# EAGLE design LCD-BackPack_v11 (EAGLE 7.5.0)
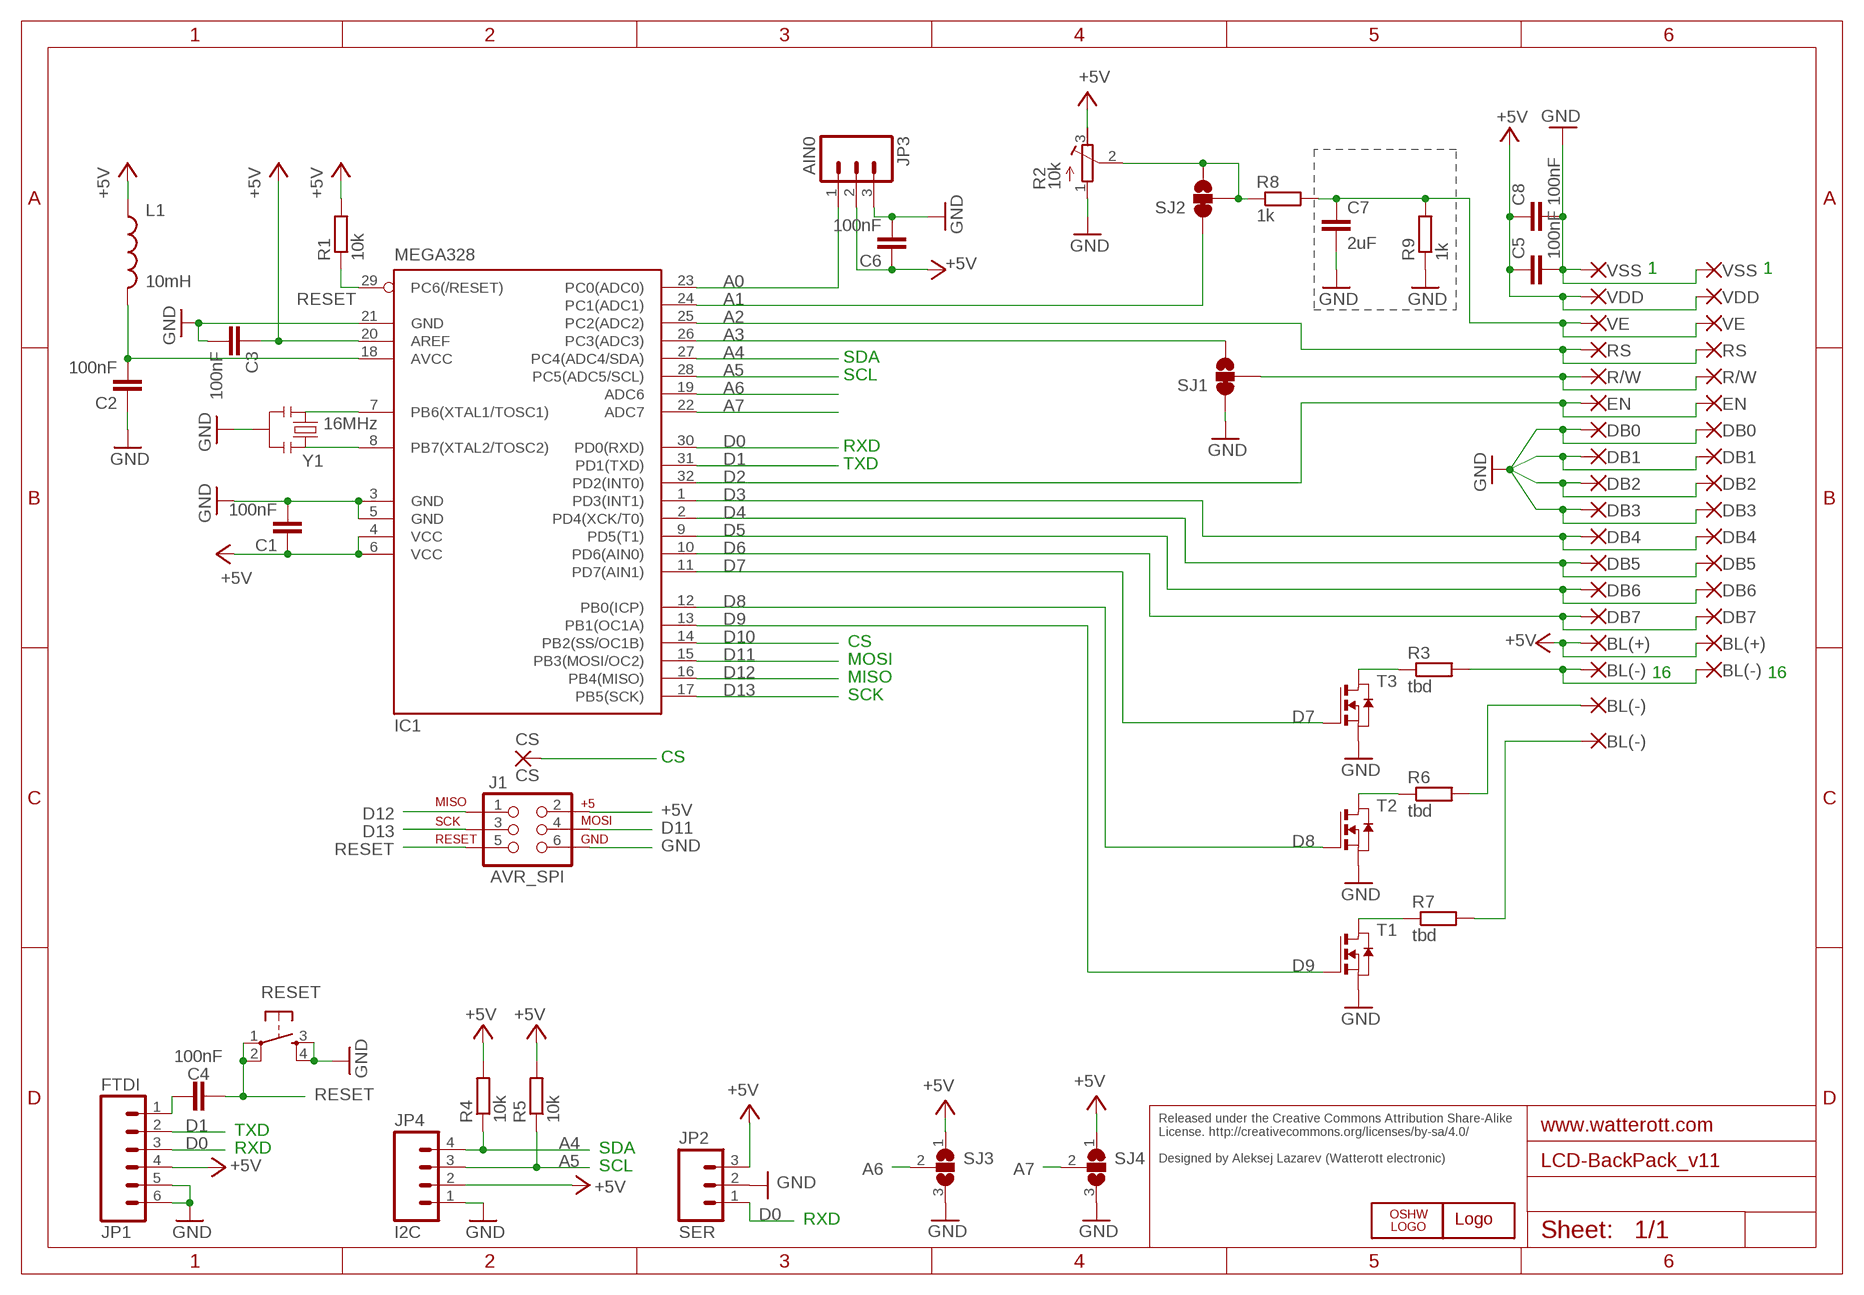
[diagram p0: schematic, sheet 1]

## Parts
C1  100nF  C-EUC0603  [C0603]
C2  100nF  C-EUC0603  [C0603]
C3  100nF  C-EUC0603  [C0603]
C4  100nF  C-EUC0603  [C0603]
C5  100nF  C-EUC0603  [C0603]
C6  100nF  C-EUC0603  [C0603]
C7  2uF  C-EUC0603  [C0603]
C8  100nF  C-EUC0603  [C0603]
CS  CS  1,6/0,9  [1,6/0,9]
IC1  MEGA328  MEGA8-AI  [TQFP32-08]
J1  AVR_SPI  AVR_SPI_PRG_6PTH  [2X3]
JP1  FTDI  M06SIP  [1X06]
JP2  SER  M03PTH  [1X03]
JP3  AIN0  M03PTH  [1X03]
JP4  I2C  M04PTH  [1X04]
L1  10mH  INDUCTOR30OHM,1.8A  [0603]
LOGO1  OSHW_LOGO_6MILX0150-NT  [OSHW_6X150_NOTEXT]
P1  VSS  1,6/0,9  [1,6/0,9]
P2  VDD  1,6/0,9  [1,6/0,9]
P3  VE  1,6/0,9  [1,6/0,9]
P4  RS  1,6/0,9  [1,6/0,9]
P5  R/W  1,6/0,9  [1,6/0,9]
P6  EN  1,6/0,9  [1,6/0,9]
P7  DB0  1,6/0,9  [1,6/0,9]
P8  DB1  1,6/0,9  [1,6/0,9]
P9  DB2  1,6/0,9  [1,6/0,9]
P10  DB3  1,6/0,9  [1,6/0,9]
P11  DB4  1,6/0,9  [1,6/0,9]
P12  DB5  1,6/0,9  [1,6/0,9]
P13  DB6  1,6/0,9  [1,6/0,9]
P14  DB7  1,6/0,9  [1,6/0,9]
P15  BL(+)  1,6/0,9  [1,6/0,9]
P16  BL(-)  1,6/0,9  [1,6/0,9]
P17  BL(-)  1,6/0,9  [1,6/0,9]
P18  BL(-)  1,6/0,9  [1,6/0,9]
P19  VSS  1,6/0,9  [1,6/0,9]
P20  VDD  1,6/0,9  [1,6/0,9]
P21  VE  1,6/0,9  [1,6/0,9]
P22  RS  1,6/0,9  [1,6/0,9]
P23  R/W  1,6/0,9  [1,6/0,9]
P24  EN  1,6/0,9  [1,6/0,9]
P25  DB0  1,6/0,9  [1,6/0,9]
P26  DB1  1,6/0,9  [1,6/0,9]
P27  DB2  1,6/0,9  [1,6/0,9]
P28  DB3  1,6/0,9  [1,6/0,9]
P29  DB4  1,6/0,9  [1,6/0,9]
P30  DB5  1,6/0,9  [1,6/0,9]
P31  DB6  1,6/0,9  [1,6/0,9]
P32  DB7  1,6/0,9  [1,6/0,9]
P33  BL(+)  1,6/0,9  [1,6/0,9]
P34  BL(-)  1,6/0,9  [1,6/0,9]
R1  10k  R-EU_R0603  [R0603]
R2  10k  R-TRIMM3374  [RTRIM3374]
R3  tbd  R-EU_R0603  [R0603]
R4  10k  R-EU_R0603  [R0603]
R5  10k  R-EU_R0603  [R0603]
R6  tbd  R-EU_R0603  [R0603]
R7  tbd  R-EU_R0603  [R0603]
R8  1k  R-EU_R0603  [R0603]
R9  1k  R-EU_R0603  [R0603]
RESET  TAC_SWITCHSMD  [TACTILE_SWITCH_SMD]
SJ1  SOLDERJUMPER_2WAY-OLDS  [SJ_3]
SJ2  SOLDERJUMPER_2WAY-OLDS  [SJ_3]
SJ3  SJ2W  [SJ_2]
SJ4  SJ2W  [SJ_2]
T1  NMOSSOT23  [SOT-23]
T2  NMOSSOT23  [SOT-23]
T3  NMOSSOT23  [SOT-23]
U$1  WE-LOGO  WE-LOGOPLACE  [WE-LOGO]
Y1  16MHz  RESONATOR16MHZ  [RESONATOR-SMD]

## Nets
+5V: C1.1 C3.1 C5.1 C6.1 C8.1 IC1.4(VCC) IC1.6(VCC) IC1.20(AREF) J1.2 JP1.4 JP2.3 JP3.2 JP4.2 L1.1 P2.1(P) P15.1(P) P20.1(P) P33.1(P) R1.2 R2.3(A) R4.2 R5.2 SJ3.1 SJ4.1
A0: IC1.23(PC0(ADC0)) JP3.1
A1: IC1.24(PC1(ADC1)) SJ2.1
A2: IC1.25(PC2(ADC2)) P4.1(P) P22.1(P)
A3: IC1.26(PC3(ADC3)) SJ1.3
A4: IC1.27(PC4(ADC4/SDA)) JP4.4 R4.1
A5: IC1.28(PC5(ADC5/SCL)) JP4.3 R5.1
A6: IC1.19(ADC6) SJ3.2
A7: IC1.22(ADC7) SJ4.2
AVCC: C2.2 IC1.18(AVCC) L1.2
D0: IC1.30(PD0(RXD)) JP1.3 JP2.1
D1: IC1.31(PD1(TXD)) JP1.2
D2: IC1.32(PD2(INT0)) P6.1(P) P24.1(P)
D3: IC1.1(PD3(INT1)) P11.1(P) P29.1(P)
D4: IC1.2(PD4(XCK/T0)) P12.1(P) P30.1(P)
D5: IC1.9(PD5(T1)) P13.1(P) P31.1(P)
D6: IC1.10(PD6(AIN0)) P14.1(P) P32.1(P)
D7: IC1.11(PD7(AIN1)) T3.3(G)
D8: IC1.12(PB0(ICP)) T2.3(G)
D9: IC1.13(PB1(OC1A)) T1.3(G)
D10: CS.1(P) IC1.14(PB2(SS/OC1B))
D11: IC1.15(PB3(MOSI/OC2)) J1.4
D12: IC1.16(PB4(MISO)) J1.1
D13: IC1.17(PB5(SCK)) J1.3
GND: C1.2 C2.1 C3.2 C5.2 C6.2 C7.2 C8.2 IC1.3(GND) IC1.5(GND) IC1.21(GND) J1.6 JP1.5 JP1.6 JP2.2 JP3.3 JP4.1 P1.1(P) P7.1(P) P8.1(P) P9.1(P) P10.1(P) P19.1(P) P25.1(P) P26.1(P) P27.1(P) P28.1(P) R2.1(E) R9.1 RESET.3 RESET.4 SJ1.1 SJ3.3 SJ4.3 T1.2(S) T2.2(S) T3.2(S) Y1.2
N$3: R6.1 T2.1(D)
N$4: P18.1(P) R7.2
N$5: C4.2 JP1.1
N$7: R3.1 T3.1(D)
N$8: P17.1(P) R6.2
N$11: R7.1 T1.1(D)
N$16: P16.1(P) P34.1(P) R3.2
RESET: C4.1 IC1.29(PC6(/RESET)) J1.5 R1.1 RESET.1 RESET.2
RW: P5.1(P) P23.1(P) SJ1.2
VE: C7.1 P3.1(P) P21.1(P) R8.2 R9.2
VPOT: R2.2(S) R8.1 SJ2.2 SJ2.3
XTAL1: IC1.7(PB6(XTAL1/TOSC1)) Y1.1
XTAL2: IC1.8(PB7(XTAL2/TOSC2)) Y1.3

## Notes on the sheet
- 1 | 1
- SDA
- SCL
- RXD
- TXD
- CS
- MOSI
- MISO | 16 | 16
- SCK
- CS
- Released under the Creative Commons Attribution Share-Alike 
  License. http://creativecommons.org/licenses/by-sa/4.0/
  
  Designed by Aleksej Lazarev (Watterott electronic)
- TXD
- RXD | SDA
- SCL
- RXD

## Library data of the parts
C1-C8 = resistor:C-EU: CAPACITOR, European symbol
CS P1-P34 = wirepad:1,6/0,9: THROUGH-HOLE PAD
IC1 = atmel:MEGA8: MICROCONTROLLER 8 Kbytes FLASH, 1 kbytes SRAM, 512 bytes EEPROM, USART, 6-channel 10 bit ADC, 2-channel 8 bit ADC Pin compatible with Atmega48, ATMega88, ATMega168 Source: avr.lbr; MPN: ATMEGA8-16AU; OC_FARNELL: 9171371; OC_NEWARK: 73M8863
J1 = SparkFun-Connectors:AVR_SPI_PRG_6: AVR ISP 6 Pin This is the reduced ISP connector for AVR programming. Common on Arduino. This footprint will take up less PCB space and can be used with a 10-pin to 6-pin adapter such as SKU: BOB-08508
JP1 = SparkFun-Connectors:M06: Header 6 Standard 6-pin 0.1" header. Use with straight break away headers (SKU : PRT-00116), right angle break away headers (PRT-00553), swiss pins (PRT-00743), machine pins (PRT-00117), and female headers (PRT-00115). Molex polarized connector foot print use with SKU : PRT-08094 with associated crimp pins and housings. NOTES ON THE VARIANTS LOCK and LOCK_LONGPADS... This footprint was designed to help hold the alignment of a through-hole component (i.e. 6-pin header) while soldering it into place. You may notice that each hole has been shifted either up or down by 0.005 of an inch from it's more standard position (which is a perfectly straight line). This slight alteration caused the pins (the squares in the middle) to touch the edges of the holes. Because they are alternating, it causes a "brace" to hold the component in place. 0.005 has proven to be the perfect amount of "off-center" position when using our standard breakaway headers. Although looks a little odd when you look at the bare footprint, once you have a header in there, the alteration is very hard to notice. Also,if you push a header all the way into place, it is covered up entirely on the bottom side. This idea of altering the position of holes to aid alignment will be further integrated into the Sparkfun Library for other footprints. It can help hold any component with 3 or more connection pins.
JP2 JP3 = SparkFun-Connectors:M03: Header 3 Standard 3-pin 0.1" header. Use with straight break away headers (SKU : PRT-00116), right angle break away headers (PRT-00553), swiss pins (PRT-00743), machine pins (PRT-00117), and female headers (PRT-00115). Molex polarized connector foot print use with SKU : PRT-08232 with associated crimp pins and housings.
JP4 = SparkFun-Connectors:M04: Header 4 Standard 4-pin 0.1" header. Use with straight break away headers (SKU : PRT-00116), right angle break away headers (PRT-00553), swiss pins (PRT-00743), machine pins (PRT-00117), and female headers (PRT-00115). Molex polarized connector foot print use with SKU : PRT-08231 with associated crimp pins and housings. 1MM SMD Version SKU: PRT-10208
L1 = SparkFun-Passives:INDUCTOR: Inductors Basic Inductor/Choke - 0603 and 1206. Footprints are not proven and vary greatly between part numbers. SRN6045- 33uH, 20% 1.4A SDR0403-560KL - 56uH, 10%, 500mA RMS/740mA peak; PROD_ID: RES-07859
LOGO1 = OSHW:OSHW_LOGO_6MIL
R1 R3-R9 = resistor:R-EU_: RESISTOR, European symbol
R2 = resistor:R-TRIMM: Trimm resistor
RESET = SparkFun-Electromechanical:TAC_SWITCH: Momentary Switch Button commonly used for reset or general input. Spark Fun Electronics SKU : COM-00097 SMT- SWCH-08247; PROD_ID: SWCH-08247
SJ1 SJ2 = SparkFun-Passives:SOLDERJUMPER_2WAY-OLD: Solder Jumper 2 way solder jumper
SJ3 SJ4 = jumper:SJ2W: SMD solder JUMPER
T1-T3 = zetex:NMOSSOT23: MOS FET; OC_FARNELL: unknown; OC_NEWARK: unknown
U$1 = welectronic:WE-LOGO
Y1 = SparkFun-FreqCtrl:RESONATOR: Resonator Small SMD resonator. Used, eg, on the Arduino Pro/ Pro Mini boards. 8MHz- XTAL-08895 16MHz- XTAL-08900; PROD_ID: XTAL-08900

## Board
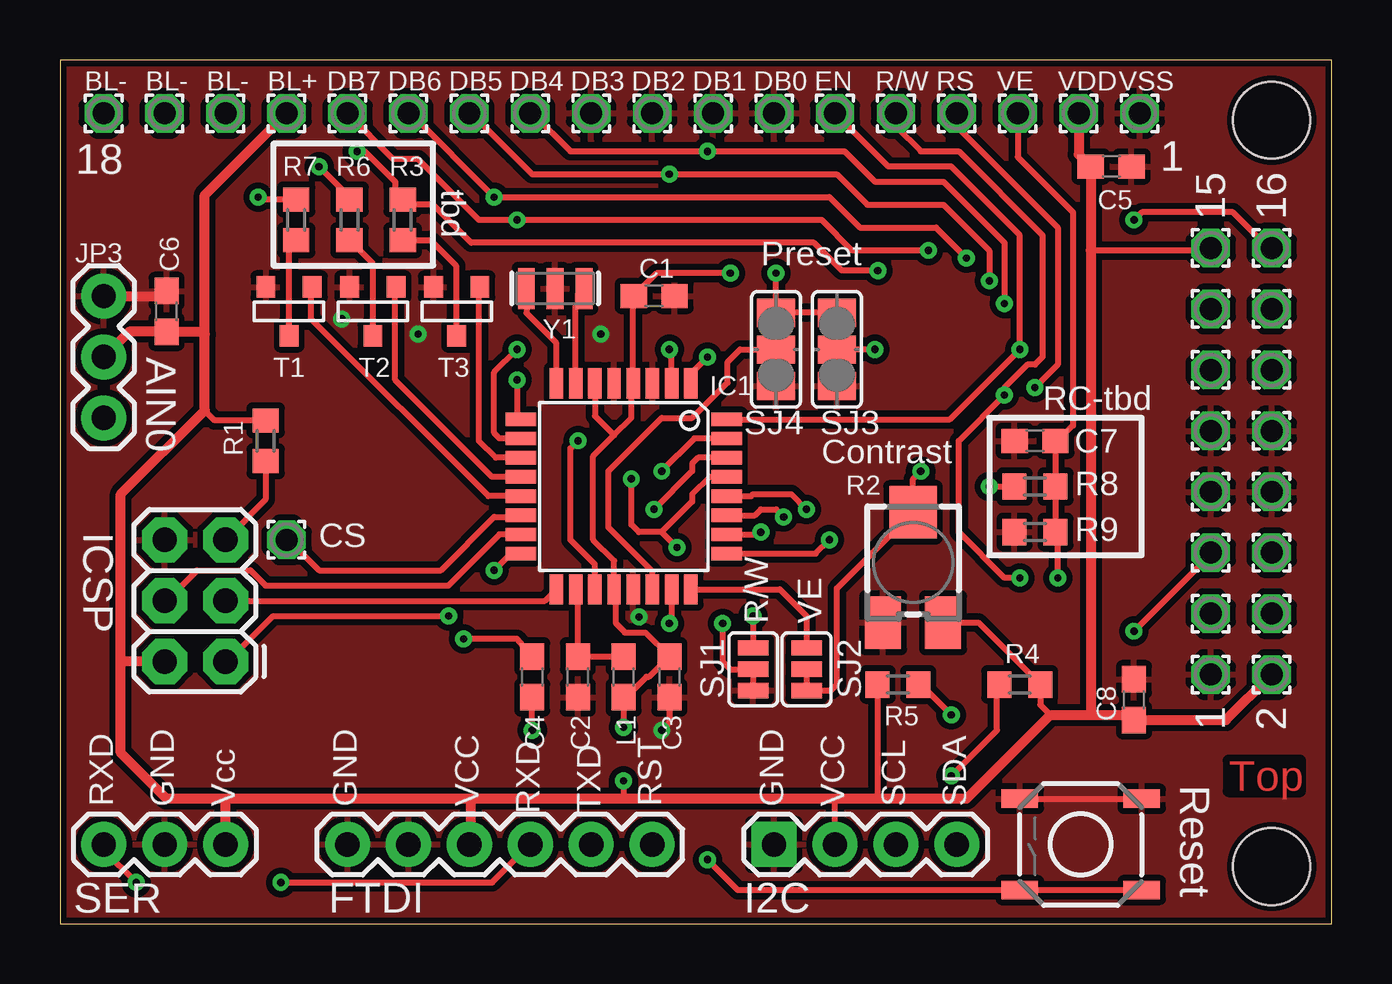
[diagram p1: board, top side]
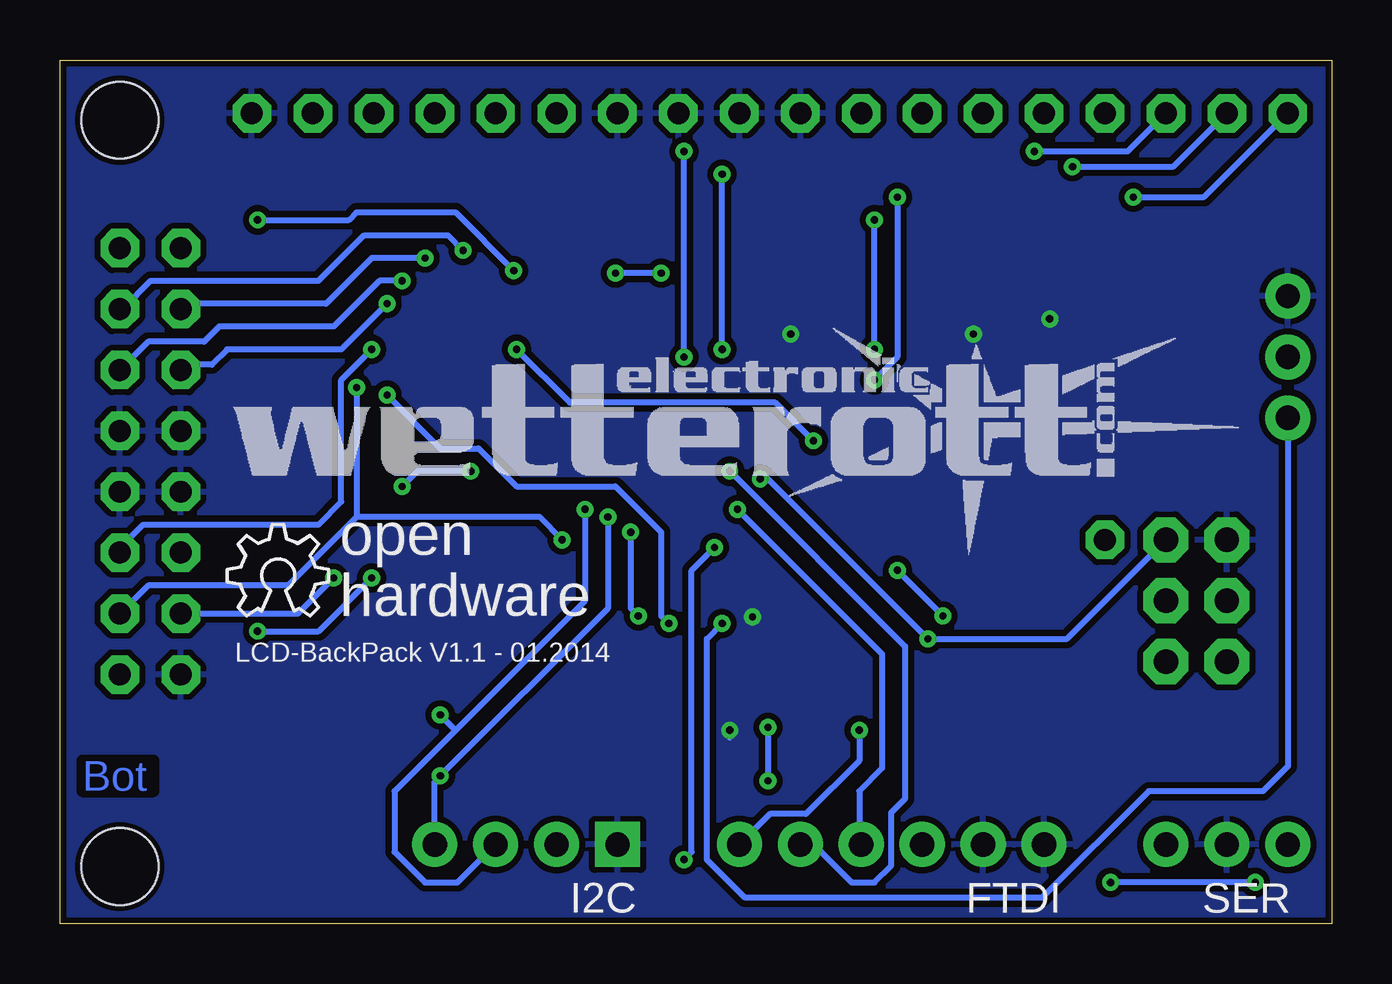
[diagram p2: board, bottom side, seen from below]

Size 53 x 36 mm. Coordinates in mm from the lower left corner, seen from the top.
Outline: 0,0 53,0 53,36 0,36 0,0
Copper layers (1*16): Top 0.035mm / dielectric 1.5mm / Bottom 0.035mm
Design rules "watterott *": minimum track width 0.1mm, minimum drill 0.3mm, track to track 0.15mm, track to pad 0.15mm, pad to pad 0.15mm, via to via 0.15mm, smd to smd 0.15mm, copper to edge 10mil, drill to drill 8mil, minimum pad ring 10mil, minimum via ring 8mil, stop-mask expansion 4mil, vias tented up to drill 0.4mm, thermal gap 10mil
Holes 3.2 mm at 50.5,33.49 50.5,2.38

### Footprints (pad centres in the part's own frame; a part is rotated, then mirrored left to right if it is on the bottom)
C0603 = smd 1.1 x 1: 1 -0.85,0; 2 0.85,0
1,6/0,9 = drill 0.914 pad 1.6 octagon: 1 0,0
TQFP32-08 = smd 1.27 x 0.559: 1 -4.293,2.8; 2 -4.293,2; 3 -4.293,1.2; 4 -4.293,0.4; 5 -4.293,-0.4; 6 -4.293,-1.2; 7 -4.293,-2; 8 -4.293,-2.8; 17 4.293,-2.8; 18 4.293,-2; 19 4.293,-1.2; 20 4.293,-0.4; 21 4.293,0.4; 22 4.293,1.2; 23 4.293,2; 24 4.293,2.8 | smd 0.559 x 1.27: 9 -2.8,-4.293; 10 -2,-4.293; 11 -1.2,-4.293; 12 -0.4,-4.293; 13 0.4,-4.293; 14 1.2,-4.293; 15 2,-4.293; 16 2.8,-4.293; 25 2.8,4.293; 26 2,4.293; 27 1.2,4.293; 28 0.4,4.293; 29 -0.4,4.293; 30 -1.2,4.293; 31 -2,4.293; 32 -2.8,4.293
2X3 = drill 1.016 pad 1.88 octagon: 1 0,0; 2 0,2.54; 3 2.54,0; 4 2.54,2.54; 5 5.08,0; 6 5.08,2.54
1X06 = drill 1.016 pad 1.88: 1 0,0; 2 2.54,0; 3 5.08,0; 4 7.62,0; 5 10.16,0; 6 12.7,0
1X03 = drill 1.016 pad 1.88: 1 0,0; 2 2.54,0; 3 5.08,0
1X04 = drill 1.016 pad 1.88 square: 1 0,0 | drill 1.016 pad 1.88: 2 2.54,0; 3 5.08,0; 4 7.62,0
0603 = smd 1.1 x 1: 1 -0.85,0; 2 0.85,0
R0603 = smd 1 x 1.1: 1 -0.85,0; 2 0.85,0
RTRIM3374 = smd 1.5 x 2.2: 1 -1.25,-2.5; 3 1.25,-2.5 | smd 1.98 x 2.17: 2 0,2.1
TACTILE_SWITCH_SMD = smd 1.524 x 0.762: 1 -2.54,1.905; 2 2.54,1.905; 3 -2.54,-1.905; 4 2.54,-1.905
SJ_3 = smd 0.635 x 1.27: 1 -0.889,0; 2 0,0; 3 0.889,0
SJ_2 = smd 1.168 x 1.6: 1 -1.524,0; 2 0,0; 3 1.524,0
SOT-23 = smd 0.787 x 0.889: 1 0.025,-1.016; 2 -0.94,1.016; 3 0.991,1.016
RESONATOR-SMD = smd 0.7 x 1.7: 1 -1.2,0; 2 0,0; 3 1.2,0

### Placement (x,y rotation side)
C1  24.77,26.16 0 top
C2  21.59,10.28 90 top
C3  25.4,10.28 270 top
C4  19.68,10.28 270 top
C5  43.81,31.55 0 top
C6  4.45,25.52 90 top
C7  40.64,20.12 180 top
C8  44.77,9.33 90 top
CS  9.44,16 0 top
IC1  23.5,18.22 270 top
J1  6.9,10.92 90 top
JP1  24.68,3.3 180 top
JP2  1.82,3.3 0 top
JP3  1.82,21.08 90 top
JP4  29.76,3.3 0 top
L1  23.5,10.28 90 top
LOGO1  46.04,12.82 0 bottom
P1  45,33.78 0 top
P2  42.46,33.78 0 top
P3  39.92,33.78 0 top
P4  37.38,33.78 0 top
P5  34.84,33.78 0 top
P6  32.3,33.78 0 top
P7  29.76,33.78 0 top
P8  27.22,33.78 0 top
P9  24.68,33.78 0 top
P10  22.14,33.78 0 top
P11  19.6,33.78 0 top
P12  17.06,33.78 0 top
P13  14.52,33.78 0 top
P14  11.98,33.78 0 top
P15  9.44,33.78 0 top
P16  6.9,33.78 0 top
P17  4.36,33.78 0 top
P18  1.82,33.78 0 top
P19  47.96,10.38 0 top
P20  50.5,10.38 0 top
P21  47.96,12.92 0 top
P22  50.5,12.92 0 top
P23  47.96,15.46 0 top
P24  50.5,15.46 0 top
P25  47.96,18 0 top
P26  50.5,18 0 top
P27  47.96,20.54 0 top
P28  50.5,20.54 0 top
P29  47.96,23.08 0 top
P30  50.5,23.08 0 top
P31  47.96,25.62 0 top
P32  50.5,25.62 0 top
P33  47.96,28.16 0 top
P34  50.5,28.16 0 top
R1  8.57,20.12 90 top
R2  35.56,15.05 0 top
R3  14.29,29.33 90 top
R4  40.01,9.96 0 top
R5  34.92,9.96 180 top
R6  12.06,29.33 90 top
R7  9.84,29.33 90 top
R8  40.64,18.22 0 top
R9  40.64,16.32 0 top
RESET  42.55,3.3 180 top
SJ1  28.89,10.6 90 top
SJ2  31.11,10.6 270 top
SJ3  32.38,23.94 270 top
SJ4  29.84,23.94 270 top
T1  9.53,25.52 0 top
T2  13.02,25.52 0 top
T3  16.51,25.52 0 top
U$1  46.04,15.05 0 bottom
Y1  20.64,26.48 180 top

### Tracks (layer width: path | path; a pad name or v marks a point on that pad's centre or on a via)
+5V  (via drill 0.3)
  Top 0.254: P33.1 47.96,28.08 47.94,28.06 42.97,28.06 | C3.1 24.55,10.28 24.45,10.28 23.6,9.43 L1.1 v23.5,8.17 | C3.1 25.4,11.23 | 36.83,12.52 R2.3 38.27,12.55 R4.2 40.85,9.11 41.27,8.7 | SJ3.1 SJ4.1 v29.84,27.11 | 23.09,20.36 22.3,21.16 IC1.6 | JP4.2 32.3,5.12 32.38,5.2 | R1.2 6.45,20.98 6.03,21.39 | v23.5,5.95 23.5,5.2 | 23.09,20.36 23.81,21.08 23.81,22.43 IC1.4 23.89,26.14 C1.1 24.87,27.11 v27.94,27.11 | 23.09,20.36 22.23,19.49 22.23,16 23.09,15.13 IC1.20 23.18,13.84 23.18,12.5 23.55,12.13 24.39,12.13 C3.1 | R5.2 34.08,5.3 33.97,5.2
  Top 0.406: P20.1 48.6,8.48 C8.1 44.55,8.7 42.86,8.7 | 17.14,5.2 23.5,5.2 32.38,5.2 33.97,5.2 37.78,5.2 41.27,8.7 42.86,8.7 | 17.14,5.2 6.99,5.2 | 6.99,5.2 4.45,5.2 2.54,7.11 2.54,10.92 | JP2.3 6.9,5.12 6.99,5.2 | 2.54,10.92 2.54,17.9 6.03,21.39 6.03,24.57 | J1.2 2.54,10.92 | 6.03,24.57 6.03,30.37 P15.1 | P2.1 42.46,32.06 C5.1 42.97,28.06 42.97,8.8 42.86,8.7 | JP3.2 2.88,24.67 C6.1 5.93,24.67 6.03,24.57 | JP1.4 17.14,3.3 17.14,5.2
  Bottom 0.254: v23.5,8.17 v23.5,5.95 | v27.94,27.11 v29.84,27.11
A0  (via drill 0.3)
  Top 0.254: IC1.23 25.5,12.6 v25.4,12.5
  Bottom 0.254: JP3.1 1.82,6.55 2.86,5.52 7.62,5.52 12.06,1.08 24.45,1.08 26.04,2.66 26.04,11.87 v25.4,12.5
A1
  Top 0.254: IC1.24 30.01,13.93 31.11,12.82 SJ2.1
A2  (via drill 0.3)
  Top 0.254: v40.64,22.35 41.59,23.3 41.59,29.02 37.47,33.14 37.47,33.7 P4.1 | IC1.25 31.49,15.42 v32.07,16
  Bottom 0.254: v40.64,22.35 40.64,16.95 | 40.64,16.95 43.5,14.09 49.33,14.09 P22.1 | v32.07,16 33.02,16.95 40.64,16.95
A3  (via drill 0.3)
  Top 0.254: IC1.26 29.11,16.22 v29.21,16.32 | v28.89,12.82 SJ1.3
  Bottom 0.254: v29.21,16.32 29.21,13.14 v28.89,12.82
A4  (via drill 0.3)
  Top 0.254: IC1.27 28.96,17.02 29.21,17.27 29.84,17.27 v30.16,16.95 | v37.15,6.16 39.05,8.06 39.05,9.86 R4.1
  Bottom 0.254: JP4.4 37.38,5.92 v37.15,6.16 30.16,13.14 v30.16,16.95
A5  (via drill 0.3)
  Top 0.254: IC1.28 28.81,17.82 28.89,17.9 30.48,17.9 v31.11,17.27 | R5.1 35.88,9.96 v37.15,8.7
  Bottom 0.254: v31.11,17.27 31.11,13.46 36.51,8.06 | 36.51,8.06 39.05,5.52 39.05,2.98 37.78,1.71 36.43,1.71 JP4.3 | v37.15,8.7 36.51,8.06
A6  (via drill 0.3)
  Top 0.254: IC1.19 22.3,14.98 21.27,16 21.27,19.81 v21.59,20.12 | v33.97,23.94 SJ3.2
  Bottom 0.254: v21.59,20.12 23.18,21.71 31.75,21.71 v33.97,23.94
A7
  Top 0.254: IC1.22 24.7,14.68 22.86,16.52 22.86,18.86 25.08,21.08 26.35,21.08 27.83,22.55 27.83,23.41 28.35,23.94 SJ4.2
AVCC
  Top 0.254: L1.2 C2.2 21.59,13.83 IC1.18
D0  (via drill 0.3)
  Top 0.254: IC1.30 26.6,19.42 26.35,19.17 26.35,18.86 v24.77,17.27 | JP2.1 1.82,3.06 v3.17,1.71 | JP1.3 18.02,1.71 v9.21,1.71
  Bottom 0.254: v24.77,17.27 18.73,11.23 18.73,6.47 19.68,5.52 19.68,3.38 JP1.3 | v3.17,1.71 v9.21,1.71
D1  (via drill 0.3)
  Top 0.254: IC1.31 26.45,20.22 v25.08,18.86
  Bottom 0.254: v25.08,18.86 17.78,11.55 17.78,5.2 18.35,4.63 18.35,2.41 19.05,1.71 20,1.71 21.59,3.3 JP1.2
D2  (via drill 0.3)
  Top 0.254: P6.1 34.52,31.55 37.15,31.55 40.01,28.7 v40.01,23.94 37.09,21.02 IC1.32
  Bottom 0.254: P24.1 50.5,15.66 49.53,16.63 42.23,16.63 41.27,17.59 41.27,22.66 v40.01,23.94
D3  (via drill 0.3)
  Top 0.254: P11.1 19.68,33.78 21.27,32.19 v26.99,32.19 32.7,32.19 33.97,30.92 36.83,30.92 39.37,28.38 v39.37,25.84 | IC1.1 26.3,22.93 v26.99,23.62
  Bottom 0.254: v39.37,25.84 41.27,23.94 46.04,23.94 46.67,23.3 47.74,23.3 P29.1 47.87,22.98 | v26.99,23.62 v26.99,32.19
D4  (via drill 0.3)
  Top 0.254: P12.1 17.14,33.78 19.68,31.24 v25.4,31.24 32.38,31.24 33.66,29.97 36.83,29.97 38.73,28.06 v38.73,26.79 | IC1.2 25.5,23.84 v25.4,23.94
  Bottom 0.254: v38.73,26.79 39.69,26.79 41.59,24.89 46.35,24.89 46.99,24.25 49.33,24.25 P30.1 | v25.4,23.94 v25.4,31.24
D5  (via drill 0.3)
  Top 0.254: P13.1 14.61,33.78 v18.1,30.29 32.07,30.29 33.34,29.02 36.51,29.02 v37.78,27.74 | v19.05,22.66 19.05,21.17 IC1.9
  Bottom 0.254: v37.78,27.74 40.01,27.74 41.91,25.84 47.74,25.84 P31.1 | v18.1,30.29 18.1,23.62 v19.05,22.66
D6  (via drill 0.3)
  Top 0.254: v36.2,28.06 33.02,28.06 31.75,29.33 v19.05,29.33 17.46,29.33 14.92,31.87 13.89,31.87 P14.1 | IC1.10 18.32,20.22 18.1,20.44 18.1,22.98 v19.05,23.94
  Bottom 0.254: P32.1 50.38,25.62 49.21,26.79 42.23,26.79 40.32,28.7 36.83,28.7 v36.2,28.06 | v19.05,23.94 v19.05,29.33
D7
  Top 0.254: IC1.11 18.17,19.42 17.46,20.12 17.46,26.5 T3.3
D8
  Top 0.254: IC1.12 18.02,18.62 13.97,22.66 13.97,26.5 T2.3
D9
  Top 0.254: IC1.13 17.86,17.82 10.48,25.2 10.48,26.5 T1.3
D10
  Top 0.254: CS.1 9.53,16 10.79,14.73 15.88,14.73 18.1,16.95 19.13,16.95 IC1.14
D11
  Top 0.254: J1.4 4.45,13.46 5.71,14.73 7.94,14.73 8.57,14.09 16.19,14.09 18.32,16.22 IC1.15
D12  (via drill 0.3)
  Top 0.254: J1.1 6.99,10.92 8.89,12.82 v16.19,12.82 | v18.1,14.73 18.73,15.36 19.14,15.36 IC1.16
  Bottom 0.254: v16.19,12.82 v18.1,14.73
D13
  Top 0.254: J1.3 20.21,13.46 IC1.17
GND  (via drill 0.3)
  Top 0.254: RESET.4 RESET.3 | C3.2 25.4,8.38 v25.08,8.06
  Top 0.406: JP3.3 4.23,26.16
  Top 0.61: 4.23,26.16 C6.2
  Bottom 0.254: v25.08,8.06 25.08,7.74
  other vias: 24.13,12.78 22.54,24.57 11.75,25.2 14.92,24.57
  pour Bottom (isolate 0.254): 0,36 53,36 53,0 0,0
  pour Top (isolate 0.254): 0,0 53,0 53,36 0,36
N$3
  Top 0.254: R6.1 13.04,27.51 T2.1
N$4  (via drill 0.3)
  Top 0.254: R7.2 8.36,30.18 v8.26,30.29
  Bottom 0.254: v8.26,30.29 5.32,30.29 P18.1
N$5  (via drill 0.3)
  Top 0.254: v19.68,8.06 C4.2
  Bottom 0.254: v19.68,8.06 19.68,6.79 21.91,4.57 23.41,4.57 JP1.1
N$7
  Top 0.254: R3.1 15.46,28.48 16.51,27.43 16.51,24.53 T3.1
N$8  (via drill 0.3)
  Top 0.254: R6.2 12.06,30.29 v10.79,31.55
  Bottom 0.254: v10.79,31.55 6.58,31.55 P17.1
N$11
  Top 0.254: T1.1 9.55,28.19 R7.1
N$16  (via drill 0.3)
  Top 0.254: R3.2 14.07,30.18 | P34.1 50.38,28.16 48.9,29.65 45.09,29.65 v44.77,29.33 | v34.09,27.22 32.59,27.22 31.43,28.38 17.14,28.38 15.56,29.97 14.5,29.97 R3.2 | v12.38,32.19 12.7,32.19 13.97,30.92 13.97,30.5 R3.2
  Bottom 0.254: v12.38,32.19 8.49,32.19 P16.1 | v44.77,29.33 40.96,29.33 40.64,29.65 36.51,29.65 v34.09,27.22
RESET  (via drill 0.3)
  Top 0.254: IC1.29 27.07,18.62 26.35,17.9 26.35,17.59 25.08,16.32 | 25.08,16.32 24.13,16.32 23.81,16.63 v23.81,18.54 | RESET.1 RESET.2 28.26,1.39 v26.99,2.66 | R1.1 8.57,17.67 J1.5 | C4.1 19.05,11.87 v16.83,11.87 | v25.72,15.68 25.08,16.32
  Bottom 0.254: v23.81,18.54 23.5,18.54 v16.83,11.87 11.03,11.87 J1.5 | v26.99,2.66 26.67,2.98 26.67,14.73 v25.72,15.68
RW  (via drill 0.3)
  Top 0.254: 28.89,9.81 SJ1.2 27.94,10.6 27.62,10.92 v27.62,12.5 | P5.1 34.84,33.23 35.88,32.19 37.47,32.19 40.96,28.7 40.96,23.62 40.64,23.3 40.32,23.3 39.37,22.35 v39.37,22.03 37.47,20.12 37.47,16.32 39.37,14.41 v40.01,14.41 | P23.1 47.96,15.38 v44.77,12.19
  Bottom 0.254: v39.37,22.03 37.15,19.81 35.56,19.81 33.97,18.22 29.84,18.22 27.94,16.32 27.94,12.82 v27.62,12.5 | v44.77,12.19 42.23,12.19 v40.01,14.41
VE  (via drill 0.3)
  Top 0.254: P3.1 39.92,31.95 42.23,29.65 42.23,20.76 41.7,20.23 41.59,20.23 C7.1 R8.2 R9.2 41.59,16.21 v41.59,14.41
  Bottom 0.254: P21.1 43.08,12.92 v41.59,14.41
VPOT  (via drill 0.3)
  Top 0.254: SJ2.2 SJ2.3 32.13,9.71 32.38,9.96 32.38,13.97 R2.2 35.56,18.54 v35.88,18.86 | v38.73,18.22 R8.1
  Bottom 0.254: v35.88,18.86 38.1,18.86 v38.73,18.22
XTAL1
  Top 0.254: IC1.7 21.5,25.74 21.59,25.84 21.59,26.23 Y1.1
XTAL2
  Top 0.254: Y1.3 19.44,25.45 20.7,24.2 IC1.8

### Text on the board
Top: Top
Bottom: Bot
tPlace: BL- | BL- | BL- | BL+ | DB7 | DB6 | DB5 | DB4 | DB3 | DB2 | DB1 | DB0 | EN | R/W | RS | VE | VDD | VSS | 18 | tbd | 1 | 15 | 16 | Preset | RC-tbd | Contrast | ICSP | CS | R/W | VE | 1 | 2 | Reset | RXD | GND | Vcc | GND | VCC | RXD | TXD | RST | GND | VCC | SCL | SDA
bPlace: open | hardware | LCD-BackPack V1.1 - 01.2014 | SER | FTDI | I2C
Reference: Silkscreen: 21 tPlace + 22 bPlace